# EAGLE design UTX_EE445M_Sensor_Board (EAGLE 9.2.2)
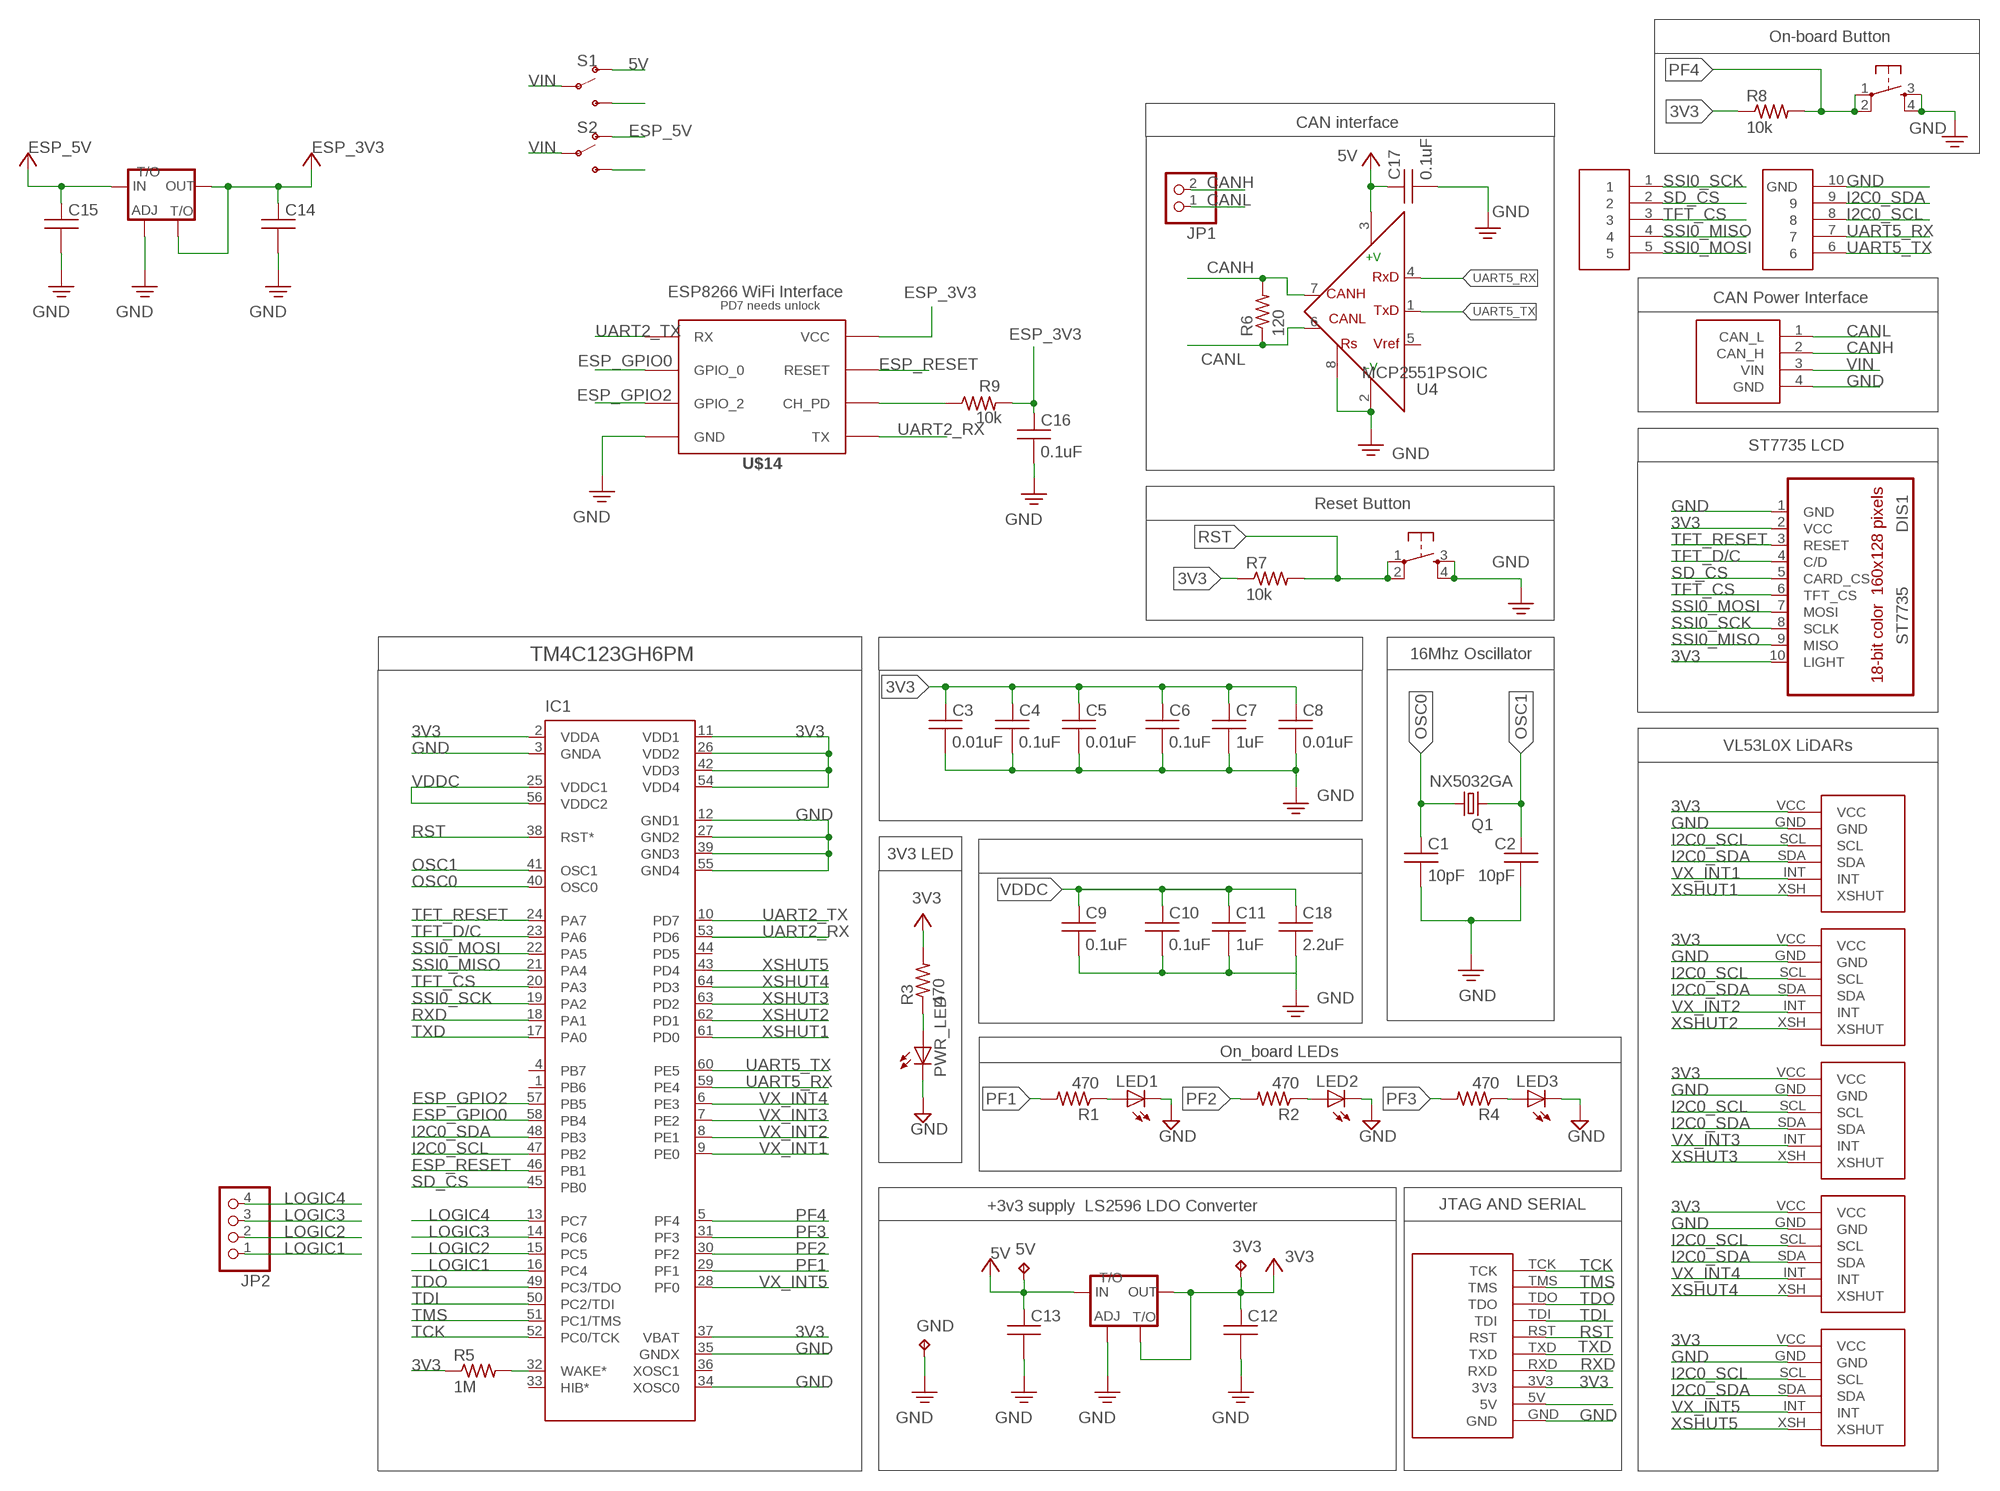
[diagram p0: schematic, sheet 1]

## Parts
3V3  TPPAD1-13  [P1-13]
5V  TPPAD1-13  [P1-13]
BUTTON  _SWITCH_DTSM-6  [_SWITCH_DTSM-6]
C1  10pF  CAPACITORC0603K  [C0603K]
C2  10pF  CAPACITORC0603K  [C0603K]
C3  0.01uF  CAPACITORC0603K  [C0603K]
C4  0.1uF  CAPACITORC0603K  [C0603K]
C5  0.01uF  CAPACITORC0603K  [C0603K]
C6  0.1uF  CAPACITORC0603K  [C0603K]
C7  1uF  CAPACITORC0603K  [C0603K]
C8  0.01uF  CAPACITORC0603K  [C0603K]
C9  0.1uF  CAPACITORC0603K  [C0603K]
C10  0.1uF  CAPACITORC0603K  [C0603K]
C11  1uF  CAPACITORC0603K  [C0603K]
C12  CAPACITORC0805K  [C0805K]
C13  CAPACITORC0603K  [C0603K]
C14  CAPACITORC0805K  [C0805K]
C15  CAPACITORC0603K  [C0603K]
C16  0.1uF  CAPACITORC0603K  [C0603K]
C17  0.1uF  CAPACITORC0603K  [C0603K]
C18  2.2uF  CAPACITORC0603K  [C0603K]
DIS1  ST7735  [ST7735]
GND  TPPAD1-13  [P1-13]
IC1  TM4C123GH6PM  [SQFP-S-10X10-64]
JP1  PINHD-1X2  [1X02]
JP2  PINHD-1X4  [1X04]
LED1  LEDCHIP-LED0603  [CHIP-LED0603]
LED2  LEDCHIP-LED0603  [CHIP-LED0603]
LED3  LEDCHIP-LED0603  [CHIP-LED0603]
PWR_LED  LEDCHIP-LED0603  [CHIP-LED0603]
Q1  NX5032GA  [NX5032GA]
R1  470  RESISTORR0603  [R0603]
R2  470  RESISTORR0603  [R0603]
R3  470  R-US_R0603  [R0603]
R4  470  RESISTORR0603  [R0603]
R5  1M  RESISTORR0603  [R0603]
R6  120  RESISTORR0603  [R0603]
R7  10k  RESISTORR0603  [R0603]
R8  10k  RESISTORR0603  [R0603]
R9  10k  RESISTORR0603  [R0603]
RESET  _SWITCH_DTSM-6  [_SWITCH_DTSM-6]
S1  SWITCH-SPDT-PTH-11.6X4.0MM  [SWITCH_SPDT_PTH_11.6X4.0MM]
S2  SWITCH-SPDT-PTH-11.6X4.0MM  [SWITCH_SPDT_PTH_11.6X4.0MM]
U4  MCP2551PSOIC  [SO08]
U$1  JTAG_SERIAL  [JTAG_SERIAL_PTH]
U$2  LIDAR_VL53L0X_ATK_VERT  [LIDAR_VL53L0X_ATK_VERT]
U$3  LIDAR_VL53L0X_ATK_VERT  [LIDAR_VL53L0X_ATK_VERT]
U$4  LIDAR_VL53L0X_ATK_VERT  [LIDAR_VL53L0X_ATK_VERT]
U$5  LIDAR_VL53L0X_ATK_VERT  [LIDAR_VL53L0X_ATK_VERT]
U$6  LIDAR_VL53L0X_ATK_VERT  [LIDAR_VL53L0X_ATK_VERT]
U$9  _VOLTAGE_REGULATOR_AMS1117  [_PACKAGE_SOT223]
U$10  UTX_EE445M_BOARD_CONNECTOR  [_HEADER_2_4X1_ANGLED]
U$11  LOGIC_ANALYZER_10PIN  [LOGIC_ANALYZER_10PIN]
U$13  _VOLTAGE_REGULATOR_AMS1117  [_PACKAGE_SOT223]
U$14  ESP-01  [ESP8266_01]

## Nets
3V3: 3V3.TP C3.1 C4.1 C5.1 C6.1 C7.1 C8.1 C12.1 DIS1.2(VCC) DIS1.10(LIGHT) IC1.2(VDDA) IC1.11(VDD1) IC1.26(VDD2) IC1.37(VBAT) IC1.42(VDD3) IC1.54(VDD4) R3.2 R5.1 R7.1 R8.1 U$1.3V3 U$2.VCC U$3.VCC U$4.VCC U$5.VCC U$6.VCC U$9.2(OUT) U$9.4(T/O) ; supply symbol labelled +5V, +3V3
5V: 5V.TP C13.1 C17.1 S1.1(O) U4.3(VDD) U$9.3(IN) ; supply symbol labelled +5V
CANH: JP1.2 R6.2 U4.7(CANH) U$10.2(CAN_H)
CANL: JP1.1 R6.1 U4.6(CANL) U$10.1(CAN_L)
ESP_3V3: C14.1 C16.1 R9.2 U$13.2(OUT) U$13.4(T/O) U$14.VCC ; supply symbol labelled +3V3
ESP_5V: C15.1 S2.1(O) U$13.3(IN) ; supply symbol labelled +5V
ESP_GPIO0: IC1.58(PB4) U$14.GPIO_0
ESP_GPIO2: IC1.57(PB5) U$14.GPIO_2
ESP_RESET: IC1.46(PB1) U$14.RESET
GND: BUTTON.3 BUTTON.4 C1.2 C2.2 C3.2 C4.2 C5.2 C6.2 C7.2 C8.2 C9.2 C10.2 C11.2 C12.2 C13.2 C14.2 C15.2 C16.2 C17.2 C18.2 DIS1.1(GND) GND.TP IC1.3(GNDA) IC1.12(GND1) IC1.27(GND2) IC1.34(XOSC0) IC1.35(GNDX) IC1.39(GND3) IC1.55(GND4) LED1.C LED2.C LED3.C PWR_LED.C RESET.3 RESET.4 U4.2(VSS) U4.8(RS) U$1.GND U$2.GND U$3.GND U$4.GND U$5.GND U$6.GND U$9.1(ADJ) U$10.4(GND) U$11.10(GND) U$13.1(ADJ) U$14.GND
I2C0_SCL: IC1.47(PB2) U$2.SCL U$3.SCL U$4.SCL U$5.SCL U$6.SCL U$11.8
I2C0_SDA: IC1.48(PB3) U$2.SDA U$3.SDA U$4.SDA U$5.SDA U$6.SDA U$11.9
LOGIC1: IC1.16(PC4) JP2.1
LOGIC2: IC1.15(PC5) JP2.2
LOGIC3: IC1.14(PC6) JP2.3
LOGIC4: IC1.13(PC7) JP2.4
N$1: R9.1 U$14.CH_PD
N$2: S2.3(S)
N$3: S1.3(S)
N$4: LED1.A R1.1
N$6: PWR_LED.A R3.1
N$7: LED2.A R2.1
N$8: LED3.A R4.1
N$18: U$1.5V
N$19: IC1.32(WAKE*) R5.2
OSC0: C1.1 IC1.40(OSC0) Q1.1
OSC1: C2.1 IC1.41(OSC1) Q1.2
PF1: IC1.29(PF1) R1.2
PF2: IC1.30(PF2) R2.2
PF3: IC1.31(PF3) R4.2
PF4: BUTTON.1 BUTTON.2 IC1.5(PF4) R8.2
RST: IC1.38(RST*) R7.2 RESET.1 RESET.2 U$1.RST
RXD: IC1.18(PA1) U$1.RXD
SD_CS: DIS1.5(CARD_CS) IC1.45(PB0) U$11.2
SSI0_MISO: DIS1.9(MISO) IC1.21(PA4) U$11.4
SSI0_MOSI: DIS1.7(MOSI) IC1.22(PA5) U$11.5
SSI0_SCK: DIS1.8(SCLK) IC1.19(PA2) U$11.1
TCK: IC1.52(PC0/TCK) U$1.TCK
TDI: IC1.50(PC2/TDI) U$1.TDI
TDO: IC1.49(PC3/TDO) U$1.TDO
TFT_CS: DIS1.6(TFT_CS) IC1.20(PA3) U$11.3
TFT_D/C: DIS1.4(C/D) IC1.23(PA6)
TFT_RESET: DIS1.3(RESET) IC1.24(PA7)
TMS: IC1.51(PC1/TMS) U$1.TMS
TXD: IC1.17(PA0) U$1.TXD
UART2_RX: IC1.53(PD6) U$14.TX
UART2_TX: IC1.10(PD7) U$14.RX
UART5_RX: IC1.59(PE4) U4.4(RXD) U$11.7
UART5_TX: IC1.60(PE5) U4.1(TXD) U$11.6
VDDC: C9.1 C10.1 C11.1 C18.1 IC1.25(VDDC1) IC1.56(VDDC2)
VIN: S1.2(P) S2.2(P) U$10.3(VIN)
VX_INT1: IC1.9(PE0) U$2.INT
VX_INT2: IC1.8(PE1) U$3.INT
VX_INT3: IC1.7(PE2) U$4.INT
VX_INT4: IC1.6(PE3) U$5.INT
VX_INT5: IC1.28(PF0) U$6.INT
XSHUT1: IC1.61(PD0) U$2.XSH(XSHUT)
XSHUT2: IC1.62(PD1) U$3.XSH(XSHUT)
XSHUT3: IC1.63(PD2) U$4.XSH(XSHUT)
XSHUT4: IC1.64(PD3) U$5.XSH(XSHUT)
XSHUT5: IC1.43(PD4) U$6.XSH(XSHUT)
Unconnected: IC1.1(PB6) IC1.4(PB7) IC1.33(HIB*) IC1.36(XOSC1) IC1.44(PD5) U4.5(VREF)

## Notes on the sheet
- On-board Button
- CAN interface
- ESP8266 WiFi Interface
- CAN Power Interface
- PD7 needs unlock
- ST7735 LCD
- Reset Button
- 16Mhz Oscillator
- VL53L0X LiDARs
- 3V3 LED
- On_board LEDs
- +3v3 supply  LS2596 LDO Converter | JTAG AND SERIAL

## Library data of the parts
3V3 5V GND = testpad:TP: Test pad
BUTTON RESET = Z:_SWITCH_DTSM-6
C1 C3-C18 = UT_ECE:CAPACITOR: CAPACITOR, American symbol
C2 = UT_ECE:CAPACITOR: CAPACITOR, American symbol; SPICEPREFIX: C
DIS1 = UT_ECE:ST7735: Sitronix ST7735R 18-bit color, 1.8" TFT LCD display, 128*160, http://www.adafruit.com/products/358 // Backlight (pin 10) connected to +3.3 V // MISO (pin 9) PA4 (SSI0Rx) // SCK (pin 8) connected to PA2 (SSI0Clk) // MOSI (pin 7) connected to PA5 (SSI0Tx) // TFT_CS (pin 6) connected to PA3 (SSI0Fss) // CARD_CS (pin 5) connected to PD7 GPIO output(for SDC) // Data/Command (pin 4) connected to PA6 (GPIO), high for data, low for command // RESET (pin 3) connected to PA7 (GPIO) // VCC (pin 2) connected to +3.3 V // Gnd (pin 1) connected to ground; OC_FARNELL: unknown; OC_NEWARK: unknown
IC1 = UT_ECE:TM4C123: Tiva™ TM4C123GH6PM Microcontroller Texas Instrument's Tiva™ C Series microcontrollers provide designers a high-performance ARM® Cortex™-M-based architecture with a broad set of integration capabilities and a strong ecosystem of software and development tools. Targeting performance and flexibility, the Tiva™ C Series architecture offers a 80 MHz Cortex-M with FPU, a variety of integrated memories and multiple programmable GPIO. Tiva™ C Series devices offer consumers compelling cost-effective solutions by integrating application-specific peripherals and providing a comprehensive library of software tools which minimize board costs and design-cycle time. Offering quicker time-to-market and cost savings, the Tiva™ C Series microcontrollers are the leading choice in high-performance 32-bit applications.
JP1 = UT_ECE:PINHD-1X2: PIN HEADER
JP2 = UT_ECE:PINHD-1X4: PIN HEADER
LED1-LED3 PWR_LED = led:LED: LED OSRAM: - CHIPLED LG R971, LG N971, LY N971, LG Q971, LY Q971, LO R971, LY R971 LH N974, LH R974 LS Q976, LO Q976, LY Q976 LO Q996 - Hyper CHIPLED LW Q18S LB Q993, LB Q99A, LB R99A - SideLED LS A670, LO A670, LY A670, LG A670, LP A670 LB A673, LV A673, LT A673, LW A673 LH A674 LY A675 LS A676, LA A676, LO A676, LY A676, LW A676 LS A679, LY A679, LG A679 - Hyper Micro SIDELED® LS Y876, LA Y876, LO Y876, LY Y876 LT Y87S - SmartLED LW L88C, LW L88S LB L89C, LB L89S, LG L890 LS L89K, LO L89K, LY L89K LS L896, LA L896, LO L896, LY L896 - TOPLED LS T670, LO T670, LY T670, LG T670, LP T670 LSG T670, LSP T670, LSY T670, LOP T670, LYG T670 LG T671, LOG T671, LSG T671 LB T673, LV T673, LT T673, LW T673 LH T674 LS T676, LA T676, LO T676, LY T676, LB T676, LH T676, LSB T676, LW T676 LB T67C, LV T67C, LT T67C, LS T67K, LO T67K, LY T67K, LW E67C LS E67B, LA E67B, LO E67B, LY E67B, LB E67C, LV E67C, LT E67C LW T67C LS T679, LY T679, LG T679 LS T770, LO T770, LY T770, LG T770, LP T770 LB T773, LV T773, LT T773, LW T773 LH T774 LS E675, LA E675, LY E675, LS T675 LS T776, LA T776, LO T776, LY T776, LB T776 LHGB T686 LT T68C, LB T68C - Hyper Mini TOPLED® LB M676 - Mini TOPLED Santana® LG M470 LS M47K, LO M47K, LY M47K Source: http://www.osram.convergy.de LUXEON: - LUMILED® LXK2-PW12-R00, LXK2-PW12-S00, LXK2-PW14-U00, LXK2-PW14-V00 LXK2-PM12-R00, LXK2-PM12-S00, LXK2-PM14-U00 LXK2-PE12-Q00, LXK2-PE12-R00, LXK2-PE12-S00, LXK2-PE14-T00, LXK2-PE14-U00 LXK2-PB12-K00, LXK2-PB12-L00, LXK2-PB12-M00, LXK2-PB14-N00, LXK2-PB14-P00, LXK2-PB14-Q00 LXK2-PR12-L00, LXK2-PR12-M00, LXK2-PR14-Q00, LXK2-PR14-R00 LXK2-PD12-Q00, LXK2-PD12-R00, LXK2-PD12-S00 LXK2-PH12-R00, LXK2-PH12-S00 LXK2-PL12-P00, LXK2-PL12-Q00, LXK2-PL12-R00 Source: www.luxeon.com KINGBRIGHT: KA-3528ASYC Source: www.kingbright.com
Q1 = UT_ECE:NX5032GA: 16 MHz Crystal 4mm SMD Digikey NX5032GA-16.000000; OC_FARNELL: unknown; OC_NEWARK: unknown
R1 R2 R4-R9 = UT_ECE:RESISTOR: RESISTOR, American symbol
R3 = rcl:R-US_: RESISTOR, American symbol; SPICEPREFIX: R
S1 S2 = SparkFun-Switches:SWITCH-SPDT: Single Pole, Double Throw (SPDT) Switch Single-pole, double-throw (SPDT) switch. Variant Overview SMD-AYZ0202 Surface Mount DPDT Switch <https://www.sparkfun.com/products/597> (COM-00597) Used on e.g. LilyPad Arduino USB - ATmega32U4 Board <https://www.sparkfun.com/products/12049> PTH-11.6X4.0MM SPDT Mini Power Switch <https://www.sparkfun.com/products/102> (COM-00102) Used on e.g. SparkFun Simon Says - Through-Hole Soldering Kit <https://www.sparkfun.com/products/10547> (KIT-10547) PTH-11.6X4.0MM-KIT KIT version of SPDT Mini Power Switch - Simplifies soldering by removing tStop of switch pins - only one side can be soldered. PTH-11.6X4.0MM-LOCK LOCK version of SPDT Mini Power Switch - Offset pins hold switch in place for easier soldering. SMD-RIGHT-ANGLE Surface Mount Right Angle Switch <https://www.sparkfun.com/products/10860> (COM-10860) Used on e.g. SparkFun ESP8266 Thing <https://www.sparkfun.com/products/13231>; PROD_ID: SWCH-08261; SF_SKU: COM-00102
U4 = UT_ECE:MCP2551P: MCP2551p CAN interface driver
U$1 = Z:JTAG_SERIAL
U$2-U$6 = Z:LIDAR_VL53L0X_ATK_VERT
U$9 U$13 = Z:_VOLTAGE_REGULATOR_AMS1117
U$10 = Z:UTX_EE445M_BOARD_CONNECTOR: Seeedstudio grove 2mm spacing, Valvano http://www.seeedstudio.com/depot/Grove-Universal-4-pin-connector-9010-PCs-p-790.html?cPath=44_80
U$11 = Z:LOGIC_ANALYZER_10PIN
U$14 = UT_ECE:ESP-01

## Board
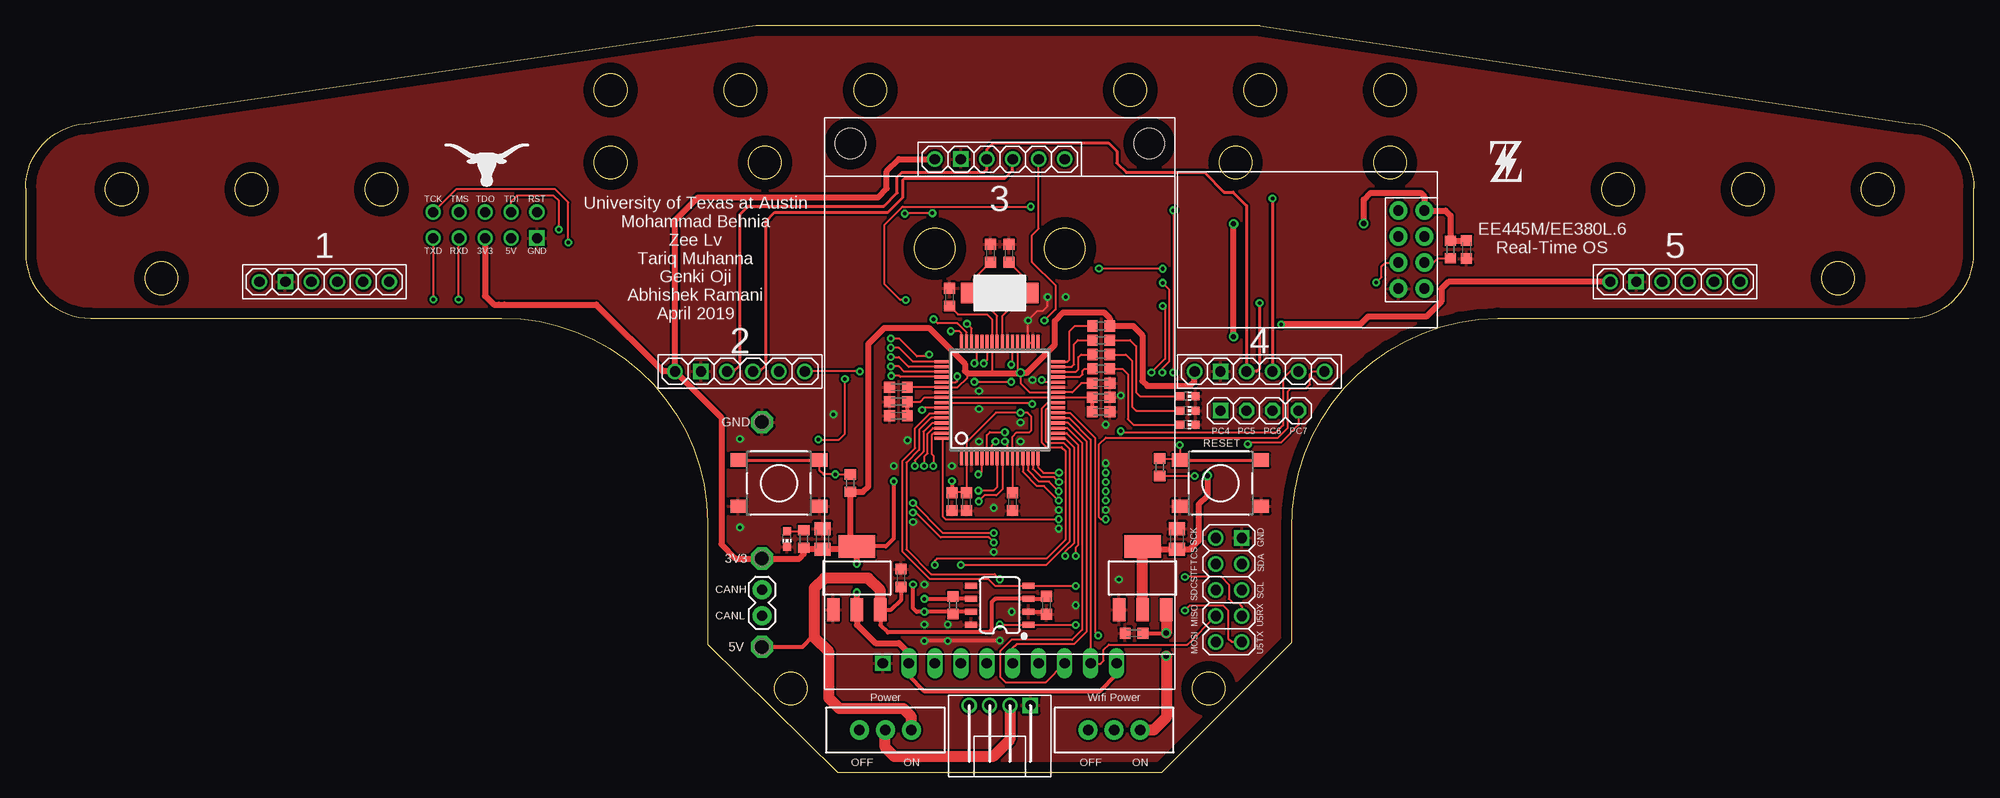
[diagram p1: board, top side]
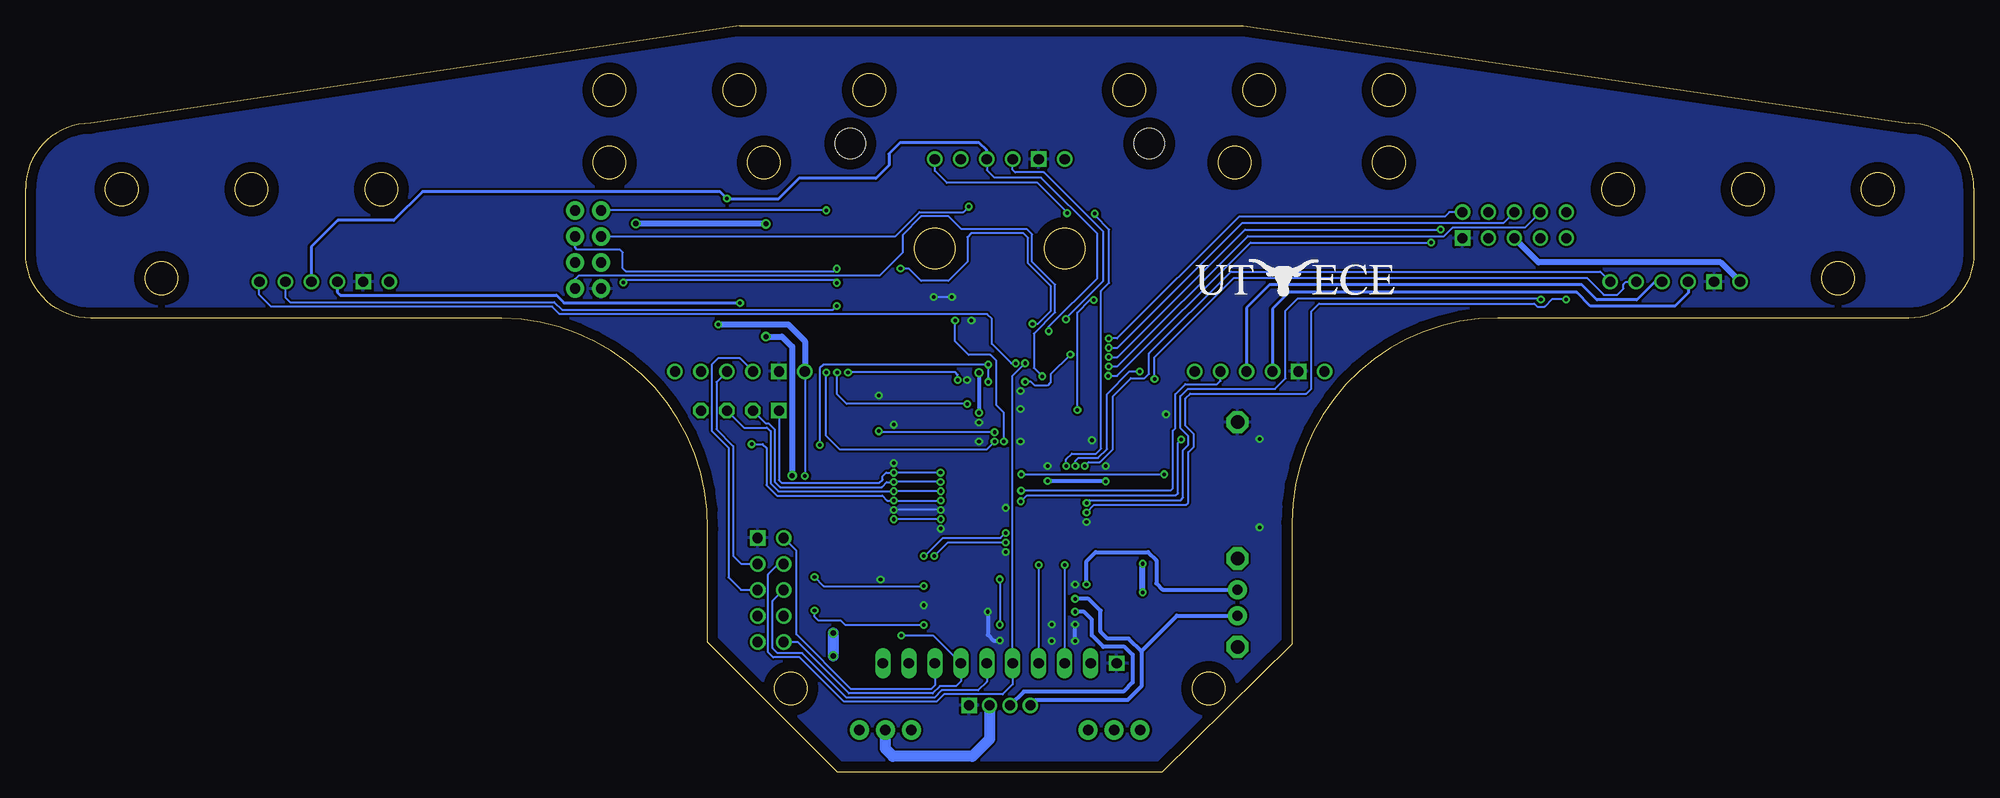
[diagram p2: board, bottom side, seen from below]

Size 190.5 x 73 mm. Coordinates in mm from the lower left corner, seen from the top.
Outline: 190.5,50.75 190.5,57.1 arc90 184.15,63.45 120.7,73 71.4,73 6.35,63.45 arc90 0,57.1 0,50.75 arc90 6.35,44.4 46.55,44.4 arc-90 66.7,24.42 66.7,12.52 79.4,0 111.1,0 123.8,12.7 123.8,23.8 arc-90 143.95,44.4 184.15,44.4 arc90 190.5,50.75
Outline: circle at 88.9,51.2 radius 2
Outline: circle at 101.6,51.2 radius 2
Outline: circle at 82.6,66.7 radius 1.6
Outline: circle at 108,66.7 radius 1.6
Outline: circle at 177.2,48.3 radius 1.6
Outline: circle at 13.3,48.3 radius 1.6
Outline: circle at 9.4,57 radius 1.6
Outline: circle at 34.8,57 radius 1.6
Outline: circle at 22.1,57 radius 1.6
Outline: circle at 120.7,66.7 radius 1.6
Outline: circle at 69.9,66.7 radius 1.6
Outline: circle at 118.3,59.6 radius 1.6
Outline: circle at 72.3,59.6 radius 1.6
Outline: circle at 133.4,59.6 radius 1.6
Outline: circle at 57.2,59.6 radius 1.6
Outline: circle at 181.1,57 radius 1.6
Outline: circle at 168.4,57 radius 1.6
Outline: circle at 155.7,57 radius 1.6
Outline: circle at 57.2,66.7 radius 1.6
Outline: circle at 133.4,66.7 radius 1.6
Copper layers (1*16): Top 0.035mm / dielectric 1.5mm / Bottom 0.035mm
Design rules "default *": minimum track width 6mil, minimum drill 0.35mm, track to track 8mil, track to pad 6mil, pad to pad 6mil, via to via 6mil, smd to smd 6mil, copper to edge 40mil, drill to drill 6mil, minimum pad ring 10mil, minimum via ring 8mil, stop-mask expansion 4mil, vias tented up to drill 0mil, thermal gap 10mil

### Footprints (pad centres in the part's own frame; a part is rotated, then mirrored left to right if it is on the bottom)
P1-13 = drill 1.321 pad 2.159 octagon: TP 0,0
_SWITCH_DTSM-6 = smd 1.55 x 1.3: 1 -3.975,2.25; 2 3.975,2.25; 3 -3.975,-2.25; 4 3.975,-2.25
C0603K = smd 1.05 x 1.08: 1 -0.875,0; 2 0.875,0
C0805K = smd 1.3 x 1.6: 1 -1,0; 2 1,0
ST7735 = drill 1 square: 1 -11.43,-26.67 | drill 1 long: 2 -8.89,-26.67; 3 -6.35,-26.67; 4 -3.81,-26.67; 5 -1.27,-26.67; 6 1.27,-26.67; 7 3.81,-26.67; 8 6.35,-26.67; 9 8.89,-26.67; 10 11.43,-26.67 | hole 3: -14.605,24.13; 14.605,24.13
SQFP-S-10X10-64 = smd 0.3 x 1.6: 1 -3.75,-5.6; 2 -3.25,-5.6; 3 -2.75,-5.6; 4 -2.25,-5.6; 5 -1.75,-5.6; 6 -1.25,-5.6; 7 -0.75,-5.6; 8 -0.25,-5.6; 9 0.25,-5.6; 10 0.75,-5.6; 11 1.25,-5.6; 12 1.75,-5.6; 13 2.25,-5.6; 14 2.75,-5.6; 15 3.25,-5.6; 16 3.75,-5.6; 33 3.75,5.6; 34 3.25,5.6; 35 2.75,5.6; 36 2.25,5.6; 37 1.75,5.6; 38 1.25,5.6; 39 0.75,5.6; 40 0.25,5.6; 41 -0.25,5.6; 42 -0.75,5.6; 43 -1.25,5.6; 44 -1.75,5.6; 45 -2.25,5.6; 46 -2.75,5.6; 47 -3.25,5.6; 48 -3.75,5.6 | smd 1.6 x 0.3: 17 5.6,-3.75; 18 5.6,-3.25; 19 5.6,-2.75; 20 5.6,-2.25; 21 5.6,-1.75; 22 5.6,-1.25; 23 5.6,-0.75; 24 5.6,-0.25; 25 5.6,0.25; 26 5.6,0.75; 27 5.6,1.25; 28 5.6,1.75; 29 5.6,2.25; 30 5.6,2.75; 31 5.6,3.25; 32 5.6,3.75; 49 -5.6,3.75; 50 -5.6,3.25; 51 -5.6,2.75; 52 -5.6,2.25; 53 -5.6,1.75; 54 -5.6,1.25; 55 -5.6,0.75; 56 -5.6,0.25; 57 -5.6,-0.25; 58 -5.6,-0.75; 59 -5.6,-1.25; 60 -5.6,-1.75; 61 -5.6,-2.25; 62 -5.6,-2.75; 63 -5.6,-3.25; 64 -5.6,-3.75
1X02 = drill 1 pad 1.88: 1 0,0; 2 2.54,0
1X04 = drill 1 square: 1 -3.81,0 | drill 1 octagon: 2 -1.27,0; 3 1.27,0; 4 3.81,0
CHIP-LED0603 = smd 0.8 x 0.8: A 0,-0.75; C 0,0.75
NX5032GA = smd 2.54 x 2: 1 -2.5,0; 2 2.5,0
R0603 = smd 1 x 1.1: 1 -0.85,0; 2 0.85,0
SWITCH_SPDT_PTH_11.6X4.0MM = drill 1.016 pad 1.88: 1 0,2.54; 2 0,0; 3 0,-2.54
SO08 = smd 0.6 x 1.2: 1 -1.905,-2.8; 2 -0.635,-2.8; 3 0.635,-2.8; 4 1.905,-2.8; 5 1.905,2.8; 6 0.635,2.8; 7 -0.635,2.8; 8 -1.905,2.8
JTAG_SERIAL_PTH = drill 1: 3V3 0,-1.27; 5V 2.54,-1.27; RST 5.08,1.27; RXD -2.54,-1.27; TCK -5.08,1.27; TDI 2.54,1.27; TDO 0,1.27; TMS -2.54,1.27; TXD -5.08,-1.27 | drill 1 square: GND 5.08,-1.27
LIDAR_VL53L0X_ATK_VERT = drill 1 square: GND -3.81,0 | drill 1: INT 3.81,0; SCL -1.27,0; SDA 1.27,0; VCC -6.35,0; XSH 6.35,0
_PACKAGE_SOT223 = smd 1.219 x 2.235: 1 -2.311,-3.099; 2 0,-3.099; 3 2.311,-3.099 | smd 3.6 x 2.2: 4 0,3.099
_HEADER_2_4X1_ANGLED = drill 1 pad 1.3: 1 -3,0; 2 -1,0; 3 1,0 | drill 1 pad 1.3 square: 4 3,0
LOGIC_ANALYZER_10PIN = drill 1: 1 -1.27,5.08; 2 -1.27,2.54; 3 -1.27,0; 4 -1.27,-2.54; 5 -1.27,-5.08; 6 1.27,-5.08; 7 1.27,-2.54; 8 1.27,0; 9 1.27,2.54 | drill 1 square: 10 1.27,5.08
ESP8266_01 = drill 1 pad 1.778: CH_PD -1.27,1.27; GND 1.27,3.81; GPIO_0 1.27,-1.27; GPIO_2 1.27,1.27; RESET -1.27,-1.27; RX 1.27,-3.81; TX -1.27,3.81; VCC -1.27,-3.81

### Placement (x,y rotation side)
3V3  72.01,20.9 0 top
5V  72.01,12.27 0 top
BUTTON  73.66,28.27 0 top
C1  96.14,50.75 90 top
C2  94.36,50.75 90 top
C3  105.16,38.05 0 top
C4  85.34,37.64 180 top
C5  92,26.47 270 top
C6  96.49,26.47 270 top
C7  90.35,46.46 90 top
C8  90.6,26.47 270 top
C9  105.16,36.65 0 top
C10  85.34,36.25 180 top
C11  105.16,35.26 0 top
C12  77.93,22.81 90 top
C13  85.6,19 90 top
C14  112.57,22.81 90 top
C15  108.38,13.62 180 top
C16  140.89,51.11 270 top
C17  99.82,16.33 270 top
C18  85.34,34.85 180 top
DIS1  95.25,37.34 0 top
GND  72.01,34.24 0 top
IC1  95.25,36.4 0 top
JP1  72.01,15.32 90 top
JP2  120.65,35.36 0 top
LED1  113.64,33.99 270 top
LED2  113.64,35.36 270 top
LED3  113.64,36.75 270 top
PWR_LED  74.45,22.81 180 top
Q1  95.25,46.86 180 top
R1  105.16,39.45 180 top
R2  105.16,40.84 180 top
R3  76.1,22.81 270 top
R4  105.16,42.24 180 top
R5  105.16,43.64 180 top
R6  90.68,16.33 270 top
R7  110.9,29.82 90 top
R8  80.64,28.27 90 top
R9  139.32,51.11 90 top
RESET  116.84,28.27 0 top
S1  84.07,4.14 270 top
S2  106.43,4.14 270 top
U4  95.25,16.33 90 top
U$1  44.93,53.49 0 top
U$2  29.21,47.96 0 top
U$3  69.85,39.19 0 top
U$4  95.25,59.94 0 top
U$5  120.65,39.19 0 top
U$6  161.29,47.96 0 top
U$7  [LOGO_LORNHORNS]  40.94,57.25 0 top
U$8  [LOGO_Z_3X4]  143.21,57.71 0 top
U$9  81.28,19 0 top
U$10  95.25,6.55 0 top
U$11  117.65,17.83 0 top
U$12  [__LOGO_UT_ECE]  76.56,46.25 0 bottom
U$13  109.22,19 0 top
U$14  135.51,51.11 180 top

### Tracks (layer width: path | path; a pad name or v marks a point on that pad's centre or on a via)
3V3  (via drill 0.35, 0.51)
  Top 0.203: C7.1 91.15,44.78 94,44.78 94.5,44.29 IC1.42 94.5,39.03 94.51,39.02 | C4.1 IC1.54 91.14,37.65 92.08,38.58 92.08,39.02 | C3.1 103.24,38.05 102.34,37.15 IC1.26 100.84,37.16 98.15,37.16 97.28,38.02 v97.28,39.07 | C6.1 IC1.11 96.5,32.82 96.9,33.22 98.15,33.22 98.35,33.43 98.35,34.77 97.97,35.15 v97.28,35.15 94.87,35.15 92,32.28 IC1.2 C5.1 91.97,27.37 90.63,27.37 C8.1 | IC1.37 97,39.04 96.98,39.02 | v114.3,28.98 114.29,28.97 R7.1
  Top 0.381: DIS1.2 86.36,9.45 87.86,7.95 105.03,7.95 106.66,9.58 106.66,10.64 DIS1.10 | v90.58,28.47 90.58,27.42 90.63,27.37 | v84.89,28.45 84.89,22.86 84.12,22.1 U$9.4 | U$9.4
  Top 0.61: DIS1.2 86.36,11.66 85.39,12.62 83.08,12.62 81.28,14.43 U$9.2 v81.28,17.6 | U$9.4 80.64,22.73 R8.1 81.88,27.42 82.4,27.94 82.4,41.88 83.97,43.46 88.32,43.46 91.85,39.93 91.85,39.24 92.08,39.02 94.51,39.02 96.98,39.02 97.23,39.02 v97.28,39.07 97.33,39.02 97.84,39.02 100.64,41.81 100.64,44.15 101.45,44.96 105.44,44.96 106.01,44.39 R5.1 108.28,43.64 109.19,42.72 109.19,38.25 109.68,37.77 113.87,37.77 114.28,38.18 114.28,39.17 U$5.VCC | v81.28,20.4 U$9.4 | U$1.3V3 44.93,46.58 45.8,45.72 46.25,45.72 46.26,45.72 46.8,45.72 55.8,45.72 62.33,39.19 U$3.VCC | U$3.VCC 68.05,34.65 68.05,22.3 69.44,20.9 3V3.TP 75.65,20.9 76.1,21.35 R3.2 76.25,21.81 C12.1 80.99,21.81 U$9.4 | U$3.VCC 63.5,53.95 65.76,56.21 83.34,56.21 84.2,57.08 84.2,58.75 85.39,59.95 U$4.VCC | U$6.VCC 139.12,47.96 138.43,47.27 138.43,46.03 136.96,44.55 131.27,44.55 130.5,43.79 v122.76,43.79
  Bottom 0.203: U$5.VCC v114.3,28.98
  Bottom 0.381: v90.58,28.47 84.91,28.47 v84.89,28.45 | v97.28,39.07 v97.28,35.15
  Bottom 0.61: v81.28,17.6 v81.28,20.4 | U$2.VCC 24.77,49.86 42.57,49.86 U$1.3V3 | v122.76,43.79 115.93,43.79 114.3,42.16 U$5.VCC
5V
  Top 0.381: C17.1 99.58,16.97 U4.3 94.79,16.97 94.46,16.64 94.46,13.95 94.21,13.69 84.3,13.69 83.59,14.4 U$9.3 84.63,15.9 85.62,16.89 85.62,18.1 C13.1 | 5V.TP 75.95,12.27 77.11,13.44
  Top 1.067: U$9.3 83.59,17.78 82.37,19 78.11,19 77.11,18.01 77.11,13.44 77.11,13.21 78.54,11.79 78.54,7.27 79.58,6.22 85.83,6.22 86.61,5.44 S1.1
CANH  (via drill 0.35)
  Top 0.381: U4.7 90.87,15.7 R6.2 90.46,15.7 v87.88,15.7 87.12,15.7 86.77,16.05 v86.77,18.36
  Bottom 0.381: U$10.2 92.9,7.9 83.16,7.9 82.27,8.79 82.27,11.51 83.03,12.27 85.11,12.27 86.23,13.39 86.23,14.94 87,15.7 v87.88,15.7 | v86.77,18.36 86.77,20.65 85.88,21.54 80.75,21.54 79.93,20.73 79.93,18.47 79.32,17.86 JP1.2
CANL  (via drill 0.35)
  Top 0.381: U4.6 90.92,16.97 R6.1 90.46,16.97 v87.88,16.97
  Bottom 0.381: 81.41,11.84 82.65,13.08 84.71,13.08 85.39,13.77 85.39,15.8 86.56,16.97 v87.88,16.97 | 81.41,11.84 81.41,8.41 82.75,7.06 91.74,7.06 U$10.1 | 81.41,11.84 77.93,15.32 JP1.1
ESP_3V3  (via drill 0.51)
  Top 0.61: U$13.4 109.51,21.81 C14.1 113.86,21.81 114.68,22.63 114.68,26.19 115.55,27.05 v115.55,29.01 | v118.11,42.6 v118.11,53.62 | v130.84,53.65 130.84,55.98 131.49,56.64 136.43,56.64 136.75,56.31 136.75,54.94 U$14.VCC 138.84,54.92 139.32,54.43 R9.2 140.87,51.96 C16.1
  Top 1.067: U$13.2 U$13.4
  Bottom 0.61: v115.55,29.01 115.55,41.61 116.53,42.6 v118.11,42.6 | v118.11,53.62 130.81,53.62 v130.84,53.65
ESP_5V  (via drill 0.51)
  Top 0.381: C15.1 v111.53,13.61
  Top 1.067: U$13.3 v111.53,13.61 | v111.53,11.38 111.53,5.39 110.29,4.14 S2.1
  Bottom 1.067: v111.53,13.61 v111.53,11.38
ESP_GPIO0  (via drill 0.35)
  Top 0.203: IC1.58 87.87,35.65 v87.66,35.43 | v86.06,46.18 85.52,46.18 84,47.7 84,53.55 85.69,55.24 85.7,55.24 85.75,55.3 v98.27,55.3
  Bottom 0.203: v87.66,35.43 87.66,44.94 86.42,46.18 v86.06,46.18 | v98.27,55.3 98.81,54.76 103.1,54.76 105.49,52.38 U$14.GPIO_0
ESP_GPIO2  (via drill 0.35)
  Top 0.203: IC1.57 98.29,36.15 v98.42,36.02 | v111.15,39.09 111.15,39.5 111.81,40.16 111.81,47.22 v111.18,47.85 | v132.06,47.88 132.59,48.41 132.59,49.45 132.97,49.84 U$14.GPIO_2
  Bottom 0.203: v98.42,36.02 110.21,36.02 111.15,36.96 v111.15,39.09 | v132.06,47.88 131.8,48.13 111.45,48.13 v111.18,47.85
ESP_RESET  (via drill 0.35)
  Top 0.203: IC1.46 92.5,43.4 v92.05,43.84 | v111.18,49.23 104.98,49.23 v104.95,49.25
  Bottom 0.203: v92.05,43.84 91.53,43.84 90.25,45.13 90.25,47.51 92.48,49.74 92.48,52.25 92.94,52.71 98.04,52.71 98.42,52.33 98.42,49.9 100.28,48.04 102.92,48.04 104.13,49.25 v104.95,49.25 | U$14.RESET 136.78,51.33 136.55,51.11 132.38,51.11 132.1,50.83 132.1,49.28 131.83,49 111.43,49 111.2,49.23 v111.18,49.23
GND  (via drill 0.35)
  Top 0.203: IC1.34 IC1.35 98,44.15 v98.02,44.17 98.96,45.11 99.47,45.11 99.92,45.57 v99.92,46.46
  Top 0.381: U4.2 99.58,15.7 C17.2 | v95.25,12.88 87.91,12.88 v87.88,12.85
  Bottom 0.203: v99.92,46.46 v101.7,46.46 | v101.02,25.65 v105.61,25.65
  Bottom 0.381: v96.42,15.7 96.42,13.44 95.86,12.88 v95.25,12.88 | v87.88,12.85 v87.88,14.45
  other vias: 93.22,37.29 86.77,24.49 106.91,18.85 98.45,38.35 105.61,33.99 93.22,32.34 87.88,18.36 97.28,32.34 97.28,34.19 86.23,32.46 84.89,29.95 105.61,30.23 107.09,36.83 102.67,16.33 94.67,21.54 93.22,35.51 90.58,29.95 94.67,25.86 69.85,32.59 69.85,23.95 78.99,35 90.17,14.45 90.17,12.85 101.02,23.83
  pour Bottom: 0,73.23 190.5,73.23 190.5,-0.35 0,-0.35
  pour Top: 0,73.23 190.5,73.23 190.5,-0.35 0,-0.35
I2C0_SCL  (via drill 0.35)
  Top 0.203: IC1.47 92,43 91.11,43.89 89.17,43.89 v88.77,44.3
  Top 0.305: U$3.SCL 69.24,39.19 69.85,39.8 69.85,54.53 70.66,55.35 83.92,55.35 85.22,56.64 85.22,58.19 85.67,58.65 93.73,58.65 93.98,58.9 U$4.SCL 93.98,60.91 94.61,61.55 105.87,61.55 106.7,60.71 106.7,59.56 107.62,58.65 115.27,58.65 117.19,56.73 118.06,56.73 119.38,55.41 U$5.SCL 120.37,39.19 120.65,39.47 v120.65,45.87
  Bottom 0.203: v88.77,44.3 88.77,44.4 85.11,48.05 85.11,52.83 90.93,58.65 93.74,58.65 93.98,58.89 U$4.SCL | U$5.SCL 120.65,40.46 122.81,40.46 123.42,39.85 123.42,33.4 121.77,31.75 121.77,19.05 120.55,17.83 U$11.8
  Bottom 0.305: U$2.SCL 27.94,46.86 29.23,45.57 37.49,45.57 38.84,46.91 66.98,46.91 68.58,45.31 U$3.SCL | U$6.SCL 160.02,46.94 159.72,46.64 138.59,46.64 137.85,45.9 120.67,45.9 v120.65,45.87
I2C0_SDA  (via drill 0.35)
  Top 0.203: IC1.48 91.5,42.93 91.29,43.13 v90.47,43.13
  Top 0.305: U$3.SDA 71.78,39.19 72.39,39.8 72.39,53.87 73.25,54.74 84.3,54.74 85.78,56.21 85.78,57.91 85.95,58.09 95.76,58.09 96.52,58.85 U$4.SDA | v121.92,56.08 U$5.SDA
  Bottom 0.203: v90.47,43.13 90.47,43.55 85.7,48.31 85.7,52.63 91.21,58.14 95.78,58.14 96.52,58.88 U$4.SDA | U$5.SDA 122.96,38.15 122.96,33.55 121.31,31.9 121.31,21.16 120.52,20.37 U$11.9
  Bottom 0.305: U$2.SDA 31.19,47.96 32.97,46.18 36.85,46.18 38.33,47.65 68.89,47.65 71.12,45.42 U$3.SDA | U$4.SDA 96.52,60.81 97.26,61.55 105,61.55 106.1,60.45 106.1,59.34 107.37,58.06 114.88,58.06 116.87,56.08 v121.92,56.08 122.61,56.77 151.69,56.77 154.51,53.95 159.97,53.95 162.56,51.36 U$6.SDA
LOGIC1  (via drill 0.35)
  Top 0.203: IC1.16 99,29.8 99.52,29.29 101.03,29.29 v101.04,29.3
  Bottom 0.203: v101.04,29.3 v105.61,29.3 106.37,29.3 106.7,28.96 106.7,28.63 107.04,28.3 116.56,28.3 116.84,28.58 JP2.1
LOGIC2  (via drill 0.35)
  Top 0.203: IC1.15 98.5,29.67 99.31,28.85 100.58,28.85 v101.04,28.39
  Bottom 0.203: v101.04,28.39 v105.61,28.39 105.62,28.37 106.3,28.37 106.78,27.89 116.73,27.89 117.25,28.41 117.25,33.53 117.83,34.11 118.14,34.11 JP2.2
LOGIC3  (via drill 0.35)
  Top 0.203: IC1.14 98,29.53 99.11,28.42 100.07,28.42 v101.02,27.48
  Bottom 0.203: v101.02,27.48 v105.61,27.48 116.89,27.48 117.65,28.24 117.65,33.35 118.01,33.71 120.27,33.71 JP2.3
LOGIC4  (via drill 0.35)
  Top 0.203: IC1.13 97.51,30.79 97.51,29.39 98.91,27.99 99.59,27.99 v101.02,26.57 | JP2.4 124.46,33.96 122.73,32.23 119.66,32.23 v119.51,32.08
  Bottom 0.203: v101.02,26.57 v105.61,26.57 106.25,26.57 106.73,27.05 117.04,27.05 118.06,28.07 118.06,31.72 118.42,32.08 v119.51,32.08
N$1
  Top 0.203: U$14.CH_PD 137.67,49.84 138.09,50.26 R9.1
N$4
  Top 0.203: R1.1 107.26,39.45 107.77,38.94 107.77,34.52 108.31,33.99 LED1.A
N$6
  Top 0.203: PWR_LED.A 76,23.56 R3.1
N$7
  Top 0.203: R2.1 107.57,40.84 108.18,40.23 108.18,35.76 108.58,35.36 LED2.A
N$8
  Top 0.203: R4.1 108,42.24 108.58,41.66 108.58,37.14 108.97,36.75 LED3.A
N$19
  Top 0.203: IC1.32 101.87,40.15 102.06,40.34 102.06,43.1 102.59,43.64 R5.2
OSC0
  Top 0.203: C1.1 97.75,48.26 Q1.1 95.5,44.61 IC1.40
OSC1
  Top 0.203: C2.1 92.75,48.26 Q1.2 95,44.61 IC1.41
PF1
  Top 0.203: IC1.29 103.09,38.65 103.35,38.91 103.35,39.24 103.56,39.45 R1.2
PF2
  Top 0.203: IC1.30 102.7,39.15 102.95,39.4 102.95,40.59 103.2,40.84 R2.2
PF3
  Top 0.203: IC1.31 102.29,39.65 102.51,39.88 102.51,41.86 102.89,42.24 R4.2
PF4  (via drill 0.35)
  Top 0.203: v93.14,29.13 93.5,29.45 IC1.5 | R8.2 80.63,29.13 v79.17,29.13 78,29.13 77.64,29.5 BUTTON.2
  Top 0.305: BUTTON.1 BUTTON.2
  Bottom 0.203: v93.14,29.13 v79.17,29.13
RST  (via drill 0.35)
  Top 0.203: v96.37,39.85 96.5,39.99 IC1.38 | v112.85,32 112.86,31.99 RESET.1 112.72,30.67 R7.2 | v88.34,40.84 88.16,40.66 87.15,40.66 85.39,42.41 v84.61,42.41 | v92.77,38.18 v96.37,38.18
  Top 0.305: RESET.1 RESET.2
  Bottom 0.203: v112.85,32 112.85,39.5 112.5,39.85 v96.37,39.85 v96.37,38.18 | U$1.RST 51.31,54.76 51.74,54.33 71.86,54.33 83.78,42.41 v84.61,42.41 | v88.34,40.84 90.27,38.91 90.27,38.13 90.6,37.8 91.8,37.8 92.18,38.18 v92.77,38.18
RXD  (via drill 0.35)
  Top 0.203: IC1.18 101.78,33.15 102.89,32.04 102.89,22.2 102.67,21.97 v102.67,21.16 | v94.67,23.39 89.72,23.39 v86.76,26.34 | v42.34,46.23 42.34,52.17 U$1.RXD
  Bottom 0.203: v102.67,21.16 102.54,21.16 100.79,22.91 95.17,22.91 94.69,23.39 v94.67,23.39 | v86.76,26.34 86.48,26.62 77.55,26.62 77.32,26.85 77.32,31.5 76.81,32 76.81,32.87 77.58,33.64 77.58,36.77 76.86,37.49 68.33,37.49 67.31,38.51 67.31,45.14 66.12,46.33 42.44,46.33 v42.34,46.23
SD_CS  (via drill 0.35)
  Top 0.203: IC1.45 93,40.22 v92.77,40 | IC1.45
  Bottom 0.203: v92.77,40 93.98,38.79 DIS1.5 93.98,8.61 94.97,7.62 100.71,7.62 101.42,6.91 110.47,6.91 114.81,11.25 117.4,11.25 117.88,11.74 117.88,19.36 116.86,20.37 U$11.2
SSI0_MISO
  Top 0.203: IC1.21 102.03,34.65 104.14,32.54 DIS1.9 104.19,10.62 105.11,10.62 105.41,10.92 105.41,11.99 105.92,12.5 113.59,12.5 U$11.4
SSI0_MOSI  (via drill 0.35)
  Top 0.203: IC1.22 102.11,35.15 104.57,32.69 104.57,13.69 v104.88,13.38
  Bottom 0.203: v104.88,13.38 101.78,13.38 DIS1.7 99.06,8.89 99.52,8.43 101.11,8.43 101.82,7.72 110,7.72 115.03,12.75 U$11.5
SSI0_SCK
  Top 0.203: IC1.19 100.87,33.63 101.88,33.63 103.3,32.21 103.3,13.92 102.34,12.95 96.39,12.95 95.28,11.84 95.28,9.35 95.86,8.76 99.7,8.76 DIS1.8
  Bottom 0.203: DIS1.8 101.6,8.52 101.99,8.13 109.78,8.13 115.14,13.48 115.14,21.67 U$11.1
TCK  (via drill 0.35)
  Top 0.203: IC1.52 85.53,38.65 85.42,38.76 v84.63,38.76 | U$1.TCK 42.09,57 51.79,57 53.06,55.73 v53.06,51.79
  Bottom 0.203: v84.63,38.76 83.77,38.76 70.74,51.79 v53.06,51.79
TDI  (via drill 0.35)
  Top 0.203: IC1.50 86.33,39.65 85.39,40.6 v84.61,40.6 | v52.15,53.06 52.15,55.85 51.61,56.39 48.06,56.39 47.45,55.78 47.45,54.79 U$1.TDI
  Bottom 0.203: v84.61,40.6 83.74,40.6 71.28,53.06 v52.15,53.06
TDO  (via drill 0.35)
  Top 0.203: IC1.49 86.75,40.15 85.39,41.5 v84.61,41.5
  Bottom 0.203: v84.61,41.5 83.74,41.5 71.53,53.72 45.97,53.72 U$1.TDO
TFT_CS
  Top 0.203: IC1.20 101.93,34.16 103.73,32.35 103.73,13.77 102.51,12.55 96.9,12.55 96.52,12.17 DIS1.6
  Bottom 0.203: DIS1.6 96.52,8.87 97.36,8.03 100.94,8.03 101.65,7.32 110.22,7.32 114.56,11.66 116.95,11.66 117.45,12.16 117.45,16.76 U$11.3
TFT_D/C  (via drill 0.35)
  Top 0.203: IC1.23 100.01,35.65 99.75,35.38 99.75,32.43 99.97,32.21 101.5,32.21 102.08,31.62 102.08,22.56 99.79,20.27 v91.44,20.27
  Bottom 0.203: v91.44,20.27 DIS1.4
TFT_RESET  (via drill 0.35)
  Top 0.203: IC1.24 99.93,36.15 99.34,35.56 99.34,32.26 99.8,31.8 101.3,31.8 101.68,31.42 101.68,22.76 99.82,20.9 89.1,20.9 88.9,20.7 v88.9,20.27
  Bottom 0.203: v88.9,20.27 DIS1.3
TMS  (via drill 0.35)
  Top 0.203: IC1.51 89.63,39.17 85.91,39.17 85.39,39.69 v84.61,39.69
  Bottom 0.203: v84.61,39.69 83.74,39.69 71,52.43 51.8,52.43 50.95,53.28 43.87,53.28 U$1.TMS
TXD  (via drill 0.35)
  Top 0.203: IC1.17 100.89,32.61 101.67,32.61 102.49,31.79 102.49,22.4 101.65,21.56 v101.65,21.16 | v94.67,22.48 94.18,22.96 89.48,22.96 87.04,25.4 v86.76,25.4 | v39.88,46.23 39.88,52.2 U$1.TXD
  Bottom 0.203: v101.65,21.16 100.33,22.48 v94.67,22.48 | v86.76,25.4 86.03,26.14 77.04,26.14 76.81,26.37 76.81,31.29 76.28,31.83 76.28,33.06 77.08,33.86 77.08,36.56 76.61,37.03 65.28,37.03 64.8,37.52 64.8,45.06 64.03,45.82 43,45.82 42.7,45.52 41.96,45.52 41.2,46.28 39.93,46.28 v39.88,46.23
UART2_RX  (via drill 0.35)
  Top 0.203: IC1.53 90.96,38.15 91.08,38.28 v91.08,38.71
  Bottom 0.203: v91.08,38.71 91.92,39.55 91.92,42.88 89.84,44.96 89.84,47.68 92.08,49.91 92.08,52.58 92.61,53.11 99.01,53.11 100.25,54.36 102.92,54.36 104.76,52.52 104.76,50.8 106.99,48.57 136.42,48.57 136.78,48.21 U$14.TX
UART2_TX  (via drill 0.35)
  Top 0.203: IC1.10 96,32.07 v95.76,32.34 | v112.22,54.94 v112.22,39.09
  Bottom 0.203: v95.76,32.34 96.53,31.55 110.87,31.55 112.22,32.89 v112.22,39.09 | v112.22,54.94 134.21,54.94 U$14.RX
UART5_RX  (via drill 0.35)
  Top 0.203: IC1.59 89.56,35.06 88.38,35.06 86.97,33.65 86.97,31.69 85.72,30.45 85.72,21.59 88.37,18.95 94.08,18.95 94.79,18.24 U4.4 98.08,18.21 v102.67,18.21 | v113.36,19.1 116.92,19.1 117.65,18.36 117.65,16.97 118.06,16.56 118.57,16.56 118.92,16.21 U$11.7
  Bottom 0.203: v102.67,18.21 112.47,18.21 v113.36,19.1
UART5_TX  (via drill 0.35)
  Top 0.203: IC1.60 88.55,34.65 87.38,33.48 87.38,31.52 86.13,30.28 86.13,21.79 88.54,19.38 94.74,19.38 v95.25,18.87 | v95.25,14.43 U4.1 98.08,14.4 v102.67,14.4 | v113.36,15.82 113.87,16.33 117.07,16.33 117.58,15.82 117.58,13.13 117.96,12.75 U$11.6
  Bottom 0.203: v95.25,18.87 v95.25,14.43 | v102.67,14.4 110.34,14.4 110.77,14.83 112.98,14.83 113.36,15.21 v113.36,15.82
VDDC
  Top 0.203: C9.1 IC1.25 IC1.56 87.91,36.65 87.5,36.25 C10.1
  Top 0.381: C9.1 C11.1 | C18.1 C10.1
VIN
  Top 1.067: U$10.3 96.25,3.21 94.59,1.55 84.94,1.55 84.05,2.44 84.05,4.12 S1.2
  Bottom 1.067: U$10.3 96.25,3.24 97.92,1.58 105.69,1.58 106.43,2.31 S2.2
VX_INT1  (via drill 0.35)
  Top 0.203: IC1.9 95.5,27.66 94.92,27.08 93.75,27.08 93.19,26.52 v93.19,26.49 | v77.52,32.54 79.53,32.54 80.11,33.12 v80.11,38.46
  Bottom 0.203: v93.19,26.49 92.61,27.08 78.05,27.08 77.83,27.31 77.83,32.23 v77.52,32.54 | v80.11,38.46 80.11,40.59 72.36,48.34 37.85,48.34 36.2,46.69 34.87,46.69 34.27,47.3 34.27,47.7 34.01,47.96 U$2.INT
VX_INT2  (via drill 0.35)
  Top 0.203: IC1.8 95,27.89 94.64,27.53 v93.17,27.53
  Bottom 0.203: v93.17,27.53 78.56,27.53 78.33,27.76 78.33,33.4 78.08,33.66 78.08,36.98 77.11,37.95 73.99,37.95 73.66,38.28 U$3.INT
VX_INT3  (via drill 0.35)
  Top 0.203: IC1.7 94.5,31.99 v94.84,32.34 | v99.62,44.17 100.71,45.26 100.71,47.6 98.42,49.89 98.42,52.53 99.06,53.16 U$4.INT
  Bottom 0.203: v94.84,32.34 94.84,35.15 95.58,35.89 95.58,40.23 96.16,40.82 98.3,40.82 99.62,42.14 v99.62,44.17
VX_INT4  (via drill 0.35)
  Top 0.203: IC1.6 94,32.96 94.28,33.25 v95.76,33.25 | v107.09,33.35 107.24,33.2 122.25,33.2 122.96,33.91 122.96,38.48 123.67,39.19 U$5.INT
  Bottom 0.203: v95.76,33.25 106.94,33.25 v107.09,33.35
VX_INT5  (via drill 0.35)
  Top 0.203: IC1.28 99.58,38.15 v99.36,38.35 | v111.18,45.59 111.4,45.39 111.4,40.41 v110.08,39.09
  Bottom 0.203: v99.36,38.35 99.36,38.89 99.57,39.09 v110.08,39.09 | U$6.INT 165.1,46.43 164.65,45.98 138.81,45.98 138.06,45.23 111.56,45.23 v111.18,45.59
XSHUT1  (via drill 0.35)
  Top 0.203: IC1.61 88.63,34.15 87.78,33.3 87.78,31.35 86.94,30.51 v86.94,29.95
  Bottom 0.203: v86.94,29.95 86.56,30.33 85.45,30.33 84.2,31.58 84.2,36.75 82.42,38.53 81.08,38.53 80.64,38.96 80.64,40.95 72.64,48.95 36.55,48.95 U$2.XSH
XSHUT2  (via drill 0.35)
  Top 0.203: v87.85,29.95 87.85,30.84 88.19,31.17 88.19,33.12 88.72,33.65 IC1.62 | v81.56,39.19 U$3.XSH
  Bottom 0.203: v87.85,29.95 87.85,30.45 87.57,30.73 85.62,30.73 84.76,31.6 84.76,36.98 82.55,39.19 v81.56,39.19
XSHUT3  (via drill 0.35)
  Top 0.203: IC1.63 88.8,33.15 88.6,32.95 88.6,31.13 88.76,30.96 v88.76,29.95 | v88.67,54.66 86,54.66 v85.95,54.61
  Bottom 0.203: v88.76,29.95 88.76,30.61 88.2,31.17 85.83,31.17 85.34,31.65 85.34,47.07 84.56,47.85 84.56,53.06 85.95,54.46 v85.95,54.61 | U$4.XSH 101.6,58.81 100.41,57.63 91.54,57.63 88.67,54.76 v88.67,54.66
XSHUT4  (via drill 0.35)
  Top 0.203: IC1.64 89.67,32.63 89.67,25.03 89.95,24.74 v101.02,24.74 | v105.61,24.74 105.16,24.74 104.97,24.92 104.97,32.08 105.61,32.72 122.45,32.72 123.42,33.68 123.42,37.24 123.72,37.54 125.2,37.54 125.58,37.92 125.58,38.89 125.88,39.19 U$5.XSH
  Bottom 0.203: v101.02,24.74 v105.61,24.74
XSHUT5  (via drill 0.35)
  Top 0.203: IC1.43 94,40.3 v93.69,39.98
  Bottom 0.203: v93.69,39.98 94.11,39.98 96.01,41.88 96.01,44.32 96.49,44.8 138.28,44.8 139,45.52 166.48,45.52 167.64,46.69 U$6.XSH

### Text on the board
tPlace: 3 | EE445M/EE380L.6 / Real-Time OS | 1 | 5 | University of Texas at Austin / Mohammad Behnia / Zee Lv / Tariq Muhanna / Genki Oji / Abhishek Ramani / April 2019 | 2 | 4
tNames: PC4 | PC5 | PC6 | PC7 | SCK | GND | TFTCS | SDA | SDCS | CANH | SCL | CANL | MISO | U5RX | MOSI | U5TX | Power | Wifi Power | OFF ON | OFF ON